# EAGLE schematic astronaut_mainboard (EAGLE 7.5.0)
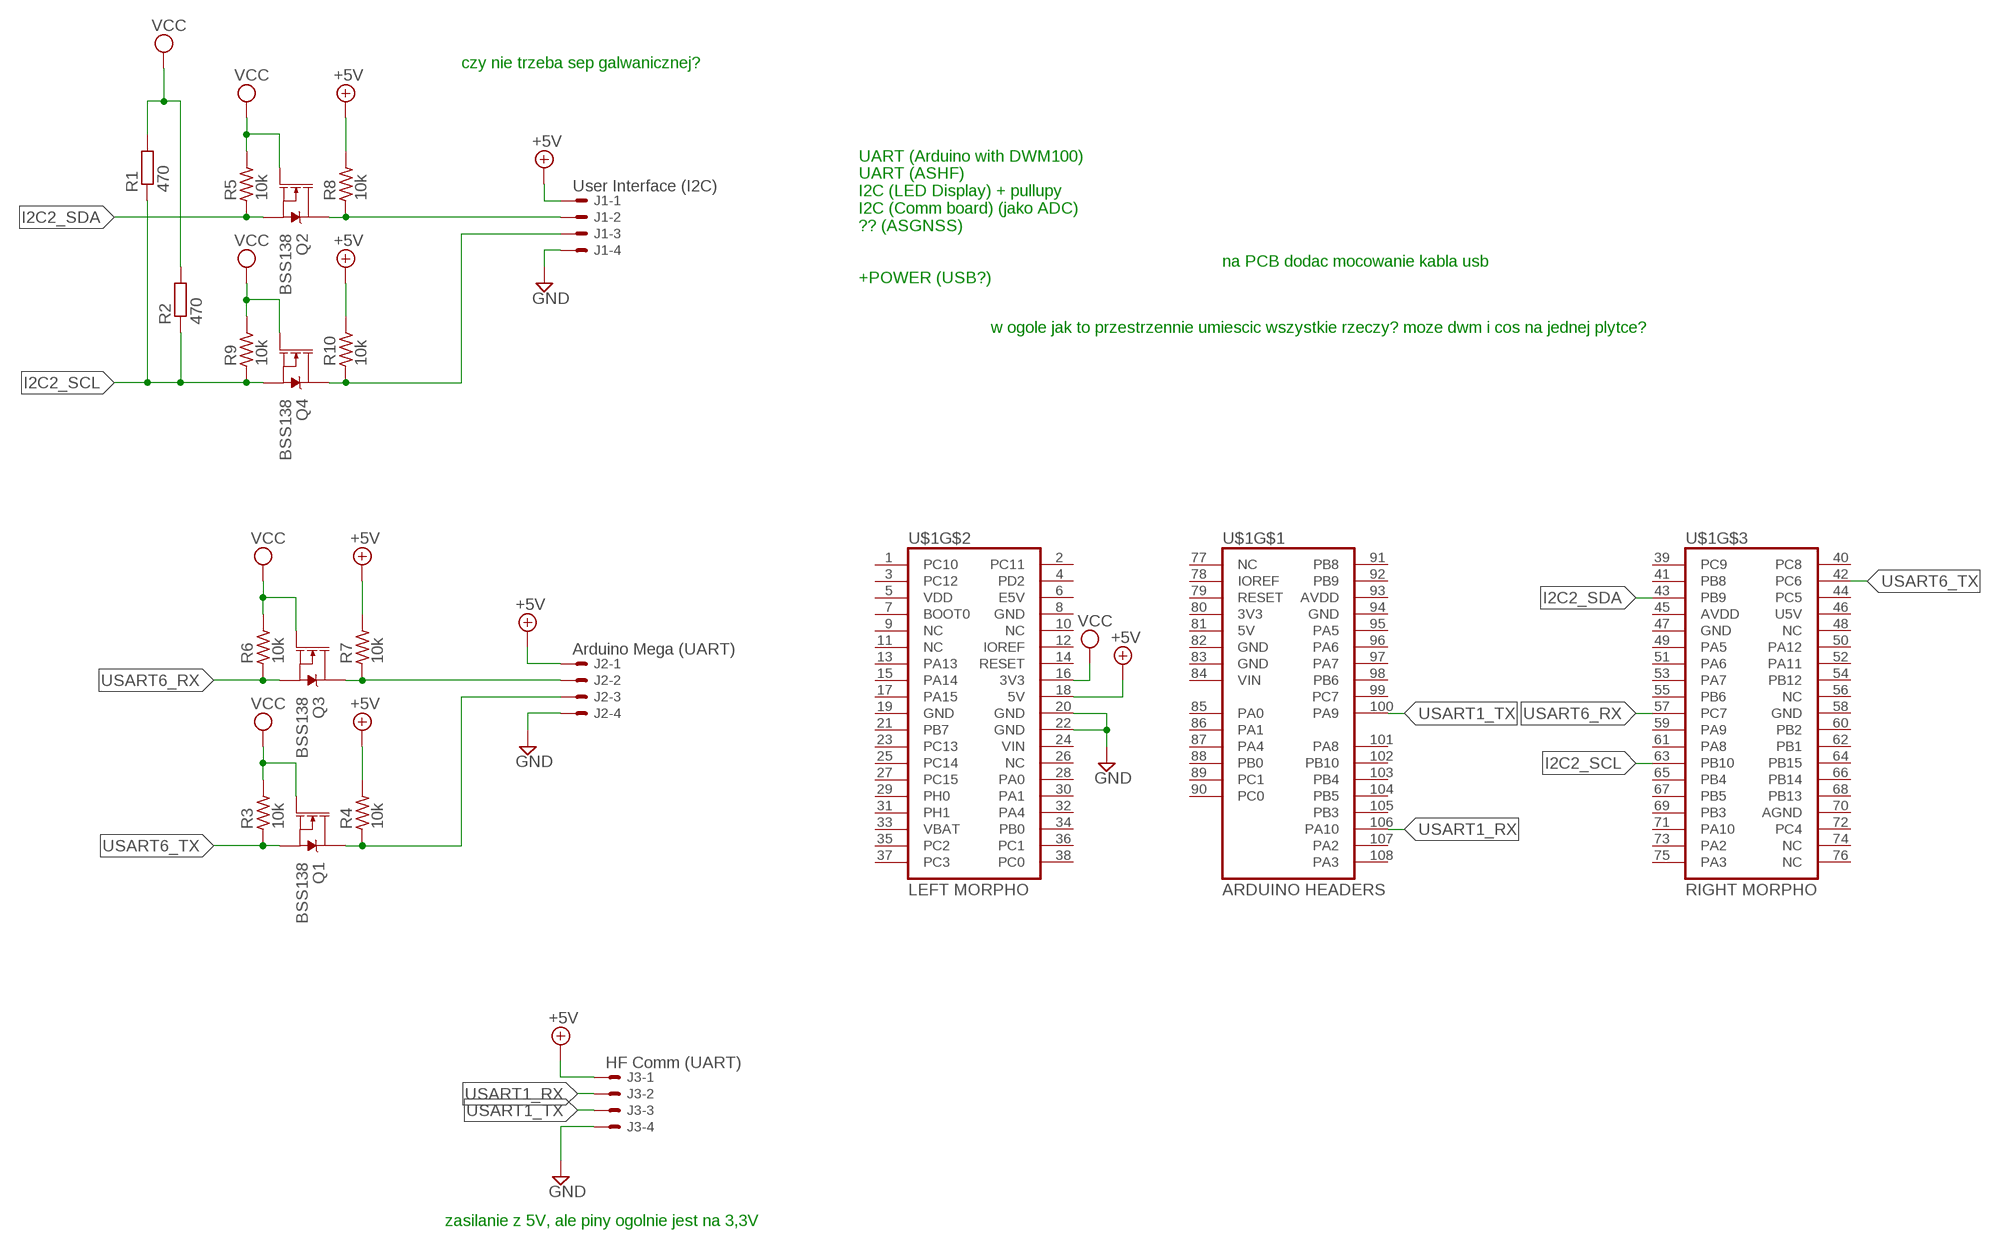
[diagram p0: schematic, sheet 1]

## Parts
J1  User Interface (I2C)  22-05-7048-04  [7395-04]
J2  Arduino Mega (UART)  22-05-7048-04  [7395-04]
J3  HF Comm (UART)  22-05-7048-04  [7395-04]
Q1  BSS138  MOSFET-NCH-AO3404A  [SOT23-3]
Q2  BSS138  MOSFET-NCH-AO3404A  [SOT23-3]
Q3  BSS138  MOSFET-NCH-AO3404A  [SOT23-3]
Q4  BSS138  MOSFET-NCH-AO3404A  [SOT23-3]
R1  470  R-EU_R0805  [R0805]
R2  470  R-EU_R0805  [R0805]
R3  10k  R_1206  [R1206]
R4  10k  R_1206  [R1206]
R5  10k  R_1206  [R1206]
R6  10k  R_1206  [R1206]
R7  10k  R_1206  [R1206]
R8  10k  R_1206  [R1206]
R9  10k  R_1206  [R1206]
R10  10k  R_1206  [R1206]
U$1  NUCLEO_F411RE  [ARDUINO+MORPHO]

## Nets
+5V: J1.1 J2.1 J3.1 R4.2 R7.2 R8.2 R10.2 U$1.18(5V)
ARDU_PIN_1: J2.2 Q3.3(D) R7.1
ARDU_PIN_2: J2.3 Q1.3(D) R4.1
ARDU_PIN_3: J1.2 Q2.3(D) R8.1
ARDU_PIN_4: J1.3 Q4.3(D) R10.1
GND: J1.4 J2.4 J3.4 U$1.20(GND) U$1.22(GND)
I2C2_SCL: Q4.2(S) R1.1 R2.1 R9.1 U$1.63(PB10)
I2C2_SDA: Q2.2(S) R5.1 U$1.43(PB9)
USART1_RX: J3.2 U$1.106(PA10)
USART1_TX: J3.3 U$1.100(PA9)
USART6_RX: Q3.2(S) R6.1 U$1.57(PC7)
USART6_TX: Q1.2(S) R3.1 U$1.42(PC6)
VCC: Q1.1(G) Q2.1(G) Q3.1(G) Q4.1(G) R1.2 R2.2 R3.2 R5.2 R6.2 R9.2 U$1.16(3V3)
Unconnected: U$1.1(PC10) U$1.2(PC11) U$1.3(PC12) U$1.4(PD2) U$1.5(VDD) U$1.6(E5V) U$1.7(BOOT0) U$1.8(GND) U$1.9(NC) U$1.10(NC) U$1.11(NC) U$1.12(IOREF) U$1.13(PA13) U$1.14(RESET) U$1.15(PA14) U$1.17(PA15) U$1.19(GND) U$1.21(PB7) U$1.23(PC13) U$1.24(VIN) U$1.25(PC14) U$1.26(NC) U$1.27(PC15) U$1.28(PA0) U$1.29(PH0) U$1.30(PA1) U$1.31(PH1) U$1.32(PA4) U$1.33(VBAT) U$1.34(PB0) U$1.35(PC2) U$1.36(PC1) U$1.37(PC3) U$1.38(PC0) U$1.39(PC9) U$1.40(PC8) U$1.41(PB8) U$1.44(PC5) U$1.45(AVDD) U$1.46(U5V) U$1.47(GND) U$1.48(NC) U$1.49(PA5) U$1.50(PA12) U$1.51(PA6) U$1.52(PA11) U$1.53(PA7) U$1.54(PB12) U$1.55(PB6) U$1.56(NC) U$1.58(GND) U$1.59(PA9) U$1.60(PB2) U$1.61(PA8) U$1.62(PB1) U$1.64(PB15) U$1.65(PB4) U$1.66(PB14) U$1.67(PB5) U$1.68(PB13) U$1.69(PB3) U$1.70(AGND) U$1.71(PA10) U$1.72(PC4) U$1.73(PA2) U$1.74(NC) U$1.75(PA3) U$1.76(NC) U$1.77(NC) U$1.78(IOREF) U$1.79(RESET) U$1.80(3V3) U$1.81(5V) U$1.82(GND) U$1.83(GND) U$1.84(VIN) U$1.85(PA0) U$1.86(PA1) U$1.87(PA4) U$1.88(PB0) U$1.89(PC1) U$1.90(PC0) U$1.91(PB8) U$1.92(PB9) U$1.93(AVDD) U$1.94(GND) U$1.95(PA5) U$1.96(PA6) U$1.97(PA7) U$1.98(PB6) U$1.99(PC7) U$1.101(PA8) U$1.102(PB10) U$1.103(PB4) U$1.104(PB5) U$1.105(PB3) U$1.107(PA2) U$1.108(PA3)

## Notes on the sheet
- czy nie trzeba sep galwanicznej?
- na PCB dodac mocowanie kabla usb
- UART (Arduino with DWM100)
  UART (ASHF)
  I2C (LED Display) + pullupy
  I2C (Comm board) (jako ADC)
  ?? (ASGNSS)
  
  
  +POWER (USB?)
- w ogole jak to przestrzennie umiescic wszystkie rzeczy? moze dwm i cos na jednej plytce?
- zasilanie z 5V, ale piny ogolnie jest na 3,3V

## Library data of the parts
J1-J3 = EP_molex_6410_7395:22-?-04: CONNECTOR wire to board 2.54 mm (.1 inch) pitch header
Q1-Q4 = SparkFun-DiscreteSemi:MOSFET-NCH: N-channel MOSFETs Voltage controlled devices that allow control of high current outputs. SparkFun Products: SparkFun OpenScale <https://www.sparkfun.com/products/13261> SparkFun Digital Sandbox <https://www.sparkfun.com/products/12651> SparkFun Monster Moto Shield <https://www.sparkfun.com/products/10182> SparkFun MOSFET Power Controller <https://www.sparkfun.com/products/11214>; PROD_ID: TRANS-12988; VALUE: 5.8A/30V/35mΩ
R1 R2 = rcl:R-EU_: RESISTOR, European symbol
R3-R10 = rc-master-smd:R_: RESISTOR
U$1 = stm32_nucleo_shield:NUCLEO_F411RE